# Altium schematic sheet XMC4800-Misc.SchDoc: XMC4800-Misc
size A4
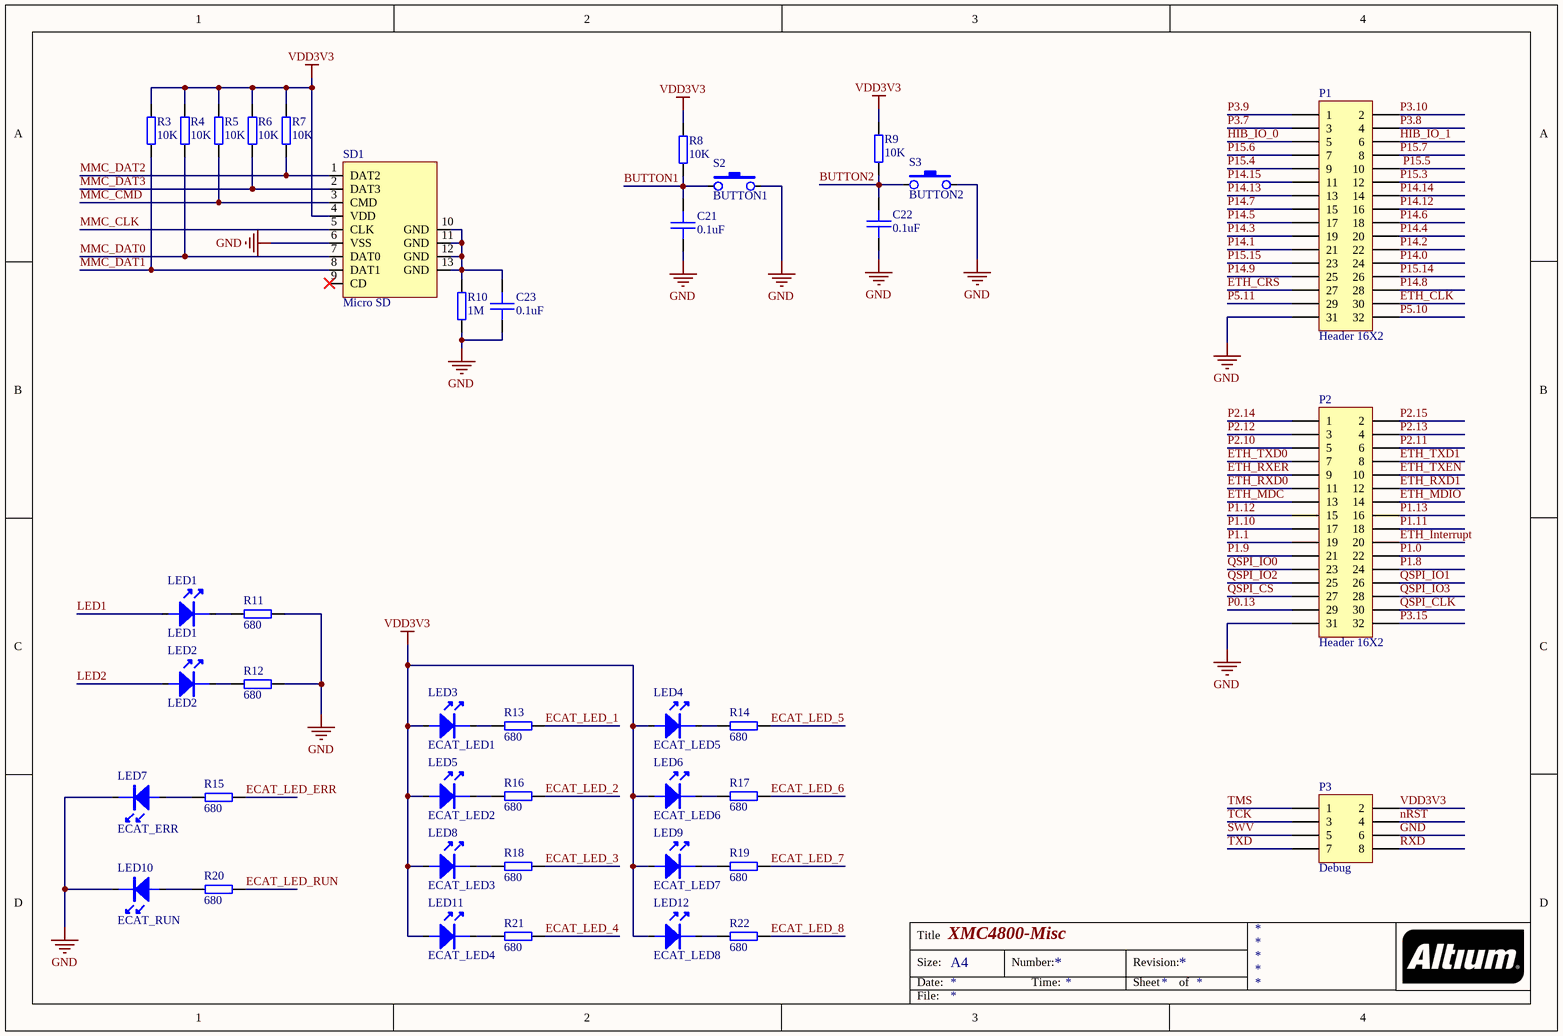
[diagram p0: XMC4800-Misc.SchDoc]

## Parts
C21  0.1uF  [CAP-0603]
C22  0.1uF  [CAP-0603]
C23  0.1uF  [CAP-0603]
LED1  LED1  [LED_0603]
LED2  LED2  [LED_0603]
LED3  ECAT_LED1  [LED_0603]
LED4  ECAT_LED5  [LED_0603]
LED5  ECAT_LED2  [LED_0603]
LED6  ECAT_LED6  [LED_0603]
LED7  ECAT_ERR  [P-LCC-2]
LED8  ECAT_LED3  [LED_0603]
LED9  ECAT_LED7  [LED_0603]
LED10  ECAT_RUN  [P-LCC-2]
LED11  ECAT_LED4  [LED_0603]
LED12  ECAT_LED8  [LED_0603]
P1  Header 16X2  [HDR2X16]
P2  Header 16X2  [HDR2X16]
P3  Debug  [HDR2X4]
R3  10K  [RES-0603]
R4  10K  [RES-0603]
R5  10K  [RES-0603]
R6  10K  [RES-0603]
R7  10K  [RES-0603]
R8  10K  [RES-0603]
R9  10K  [RES-0603]
R10  1M  [RES-0603]
R11  680  [RES-0603]
R12  680  [RES-0603]
R13  680  [RES-0603]
R14  680  [RES-0603]
R15  680  [RES-0603]
R16  680  [RES-0603]
R17  680  [RES-0603]
R18  680  [RES-0603]
R19  680  [RES-0603]
R20  680  [RES-0603]
R21  680  [RES-0603]
R22  680  [RES-0603]
S2  BUTTON1  [KEY_3X4X2]
S3  BUTTON2  [KEY_3X4X2]
SD1  Micro SD  [7MSDP-B0-1012]

## Nets
GND: C21.2 C22.2 C23.2 LED7.C(K) LED10.C(K) P1.31 P2.31 P3.6 R10.1 R11.2 R12.2 S2.2 S3.2 SD1.6(VSS)
VDD3V3: LED3.1(A) LED4.1(A) LED5.1(A) LED6.1(A) LED8.1(A) LED9.1(A) LED11.1(A) LED12.1(A) P3.2 R3.2 R4.2 R5.2 R6.2 R7.2 R8.2 R9.2 SD1.4(VDD)
BUTTON1: C21.1 R8.1 S2.1
BUTTON2: C22.1 R9.1 S3.1
ECAT_LED_1: R13.2
ECAT_LED_2: R16.2
ECAT_LED_3: R18.2
ECAT_LED_4: R21.2
ECAT_LED_5: R14.2
ECAT_LED_6: R17.2
ECAT_LED_7: R19.2
ECAT_LED_8: R22.2
ECAT_LED_ERR: R15.2
ECAT_LED_RUN: R20.2
ETH_CLK: P1.30
ETH_CRS: P1.27
ETH_Interrupt: P2.20
ETH_MDC: P2.13
ETH_MDIO: P2.14
ETH_RXD0: P2.11
ETH_RXD1: P2.12
ETH_RXER: P2.9
ETH_TXD0: P2.7
ETH_TXD1: P2.8
ETH_TXEN: P2.10
HIB_IO_0: P1.5
HIB_IO_1: P1.6
LED1: LED1.1(A)
LED2: LED2.1(A)
MMC_CLK: SD1.5(CLK)
MMC_CMD: R5.1 SD1.3(CMD)
MMC_DAT0: R4.1 SD1.7(DAT0)
MMC_DAT1: R3.1 SD1.8(DAT1)
MMC_DAT2: R7.1 SD1.1(DAT2)
MMC_DAT3: R6.1 SD1.2(DAT3)
nRST: P3.4
P0.13: P2.29
P1.0: P2.22
P1.1: P2.19
P1.8: P2.24
P1.9: P2.21
P1.10: P2.17
P1.11: P2.18
P1.12: P2.15
P1.13: P2.16
P2.10: P2.5
P2.11: P2.6
P2.12: P2.3
P2.13: P2.4
P2.14: P2.1
P2.15: P2.2
P3.7: P1.3
P3.8: P1.4
P3.9: P1.1
P3.10: P1.2
P3.15: P2.32
P5.10: P1.32
P5.11: P1.29
P14.0: P1.24
P14.1: P1.21
P14.2: P1.22
P14.3: P1.19
P14.4: P1.20
P14.5: P1.17
P14.6: P1.18
P14.7: P1.15
P14.8: P1.28
P14.9: P1.25
P14.12: P1.16
P14.13: P1.13
P14.14: P1.14
P14.15: P1.11
P15.3: P1.12
P15.4: P1.9
P15.5: P1.10
P15.6: P1.7
P15.7: P1.8
P15.14: P1.26
P15.15: P1.23
QSPI_CLK: P2.30
QSPI_CS: P2.27
QSPI_IO0: P2.23
QSPI_IO1: P2.26
QSPI_IO2: P2.25
QSPI_IO3: P2.28
RXD: P3.8
SWV: P3.5
TCK: P3.3
TMS: P3.1
TXD: P3.7
NetC23_1: C23.1 R10.2 SD1.10(GND) SD1.11(GND) SD1.12(GND) SD1.13(GND)
NetLED1_2: LED1.2(K) R11.1
NetLED2_2: LED2.2(K) R12.1
NetLED3_2: LED3.2(K) R13.1
NetLED4_2: LED4.2(K) R14.1
NetLED5_2: LED5.2(K) R16.1
NetLED6_2: LED6.2(K) R17.1
NetLED7_A: LED7.A R15.1
NetLED8_2: LED8.2(K) R18.1
NetLED9_2: LED9.2(K) R19.1
NetLED10_A: LED10.A R20.1
NetLED11_2: LED11.2(K) R21.1
NetLED12_2: LED12.2(K) R22.1

Not connected (* = marked no-connect by the designer): SD1 9(CD)*

## Notes on the sheet
- Title
- Size:
- Date:
- A4
- Number:
- Time:
- Revision:
- Sheet
- of
- File:

## Library data of the parts
C21-C23 = C_0603: 陶瓷贴片电容0603; tolerance: 10%; voltage: 50V; ESR: 1.73mOhm; IRMS: 5.59A; C_value: 0.1uF; Series: X7R
LED1-LED6 LED8 LED9 LED11 LED12 = LED_0603: 0603封装发光二极管
LED7 LED10 = LED_3528: 3528封装发光二极管
P1 P2 = Header 16X2: Header, 16-Pin, Dual row; LatestRevisionDate: 17-Jul-2002; LatestRevisionNote: Re-released for DXP Platform.; Publisher: Altium Limited
P3 = Header 4X2: Header, 4-Pin, Dual row; LatestRevisionDate: 17-Jul-2002; LatestRevisionNote: Re-released for DXP Platform.; Publisher: Altium Limited
R3-R22 = R_0603: 贴片电阻0603; tolerance: 5%; voltage: 50V; power: 0.063W
  R3-R9: R_value: 10K
  R10: R_value: 1M
  R11-R22: R_value: 680
S2 S3 = KEY: 轻触开关3X4X2
SD1 = Micro SD: Micro SD卡座